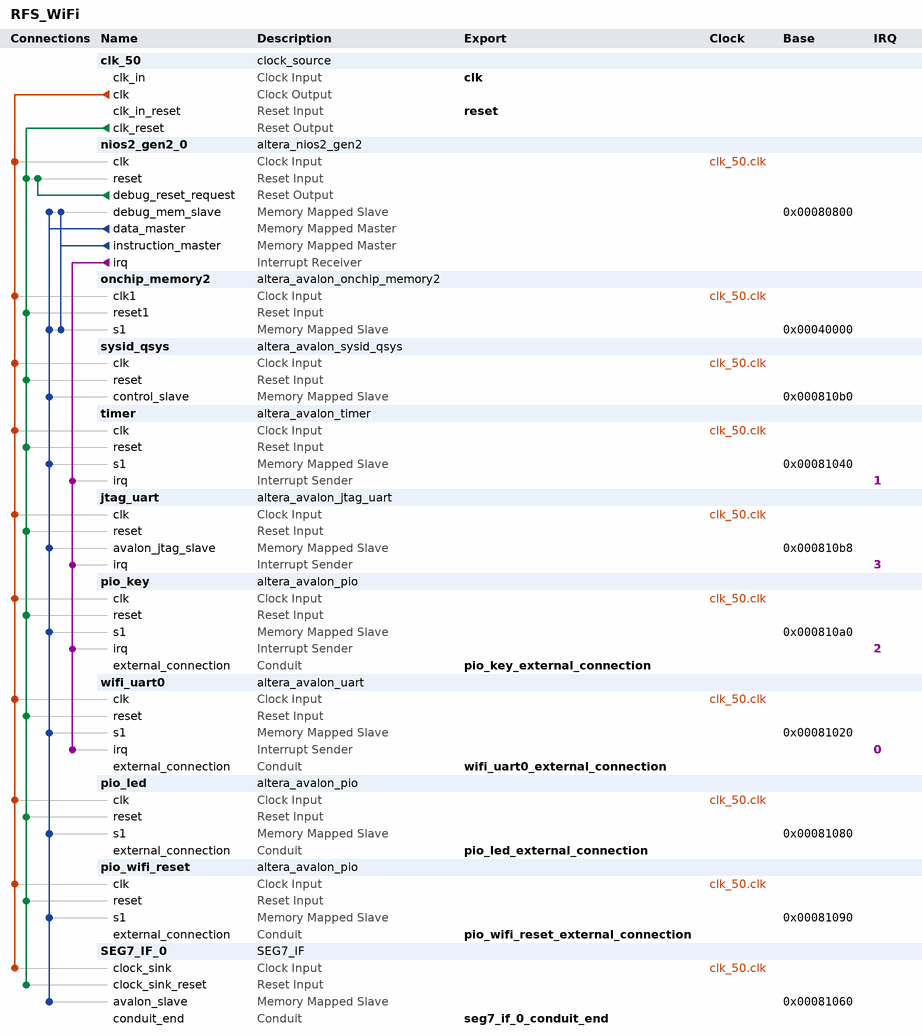
[diagram p0: system contents]
# Platform Designer (Qsys) system RFS_WiFi, Cyclone V 5CSEBA6U23I7
# Parameters at their usual value, and those the tool derives, are not listed.
package require -exact qsys 16.1
create_system RFS_WiFi
set_project_property DEVICE_FAMILY {Cyclone V}
set_project_property DEVICE 5CSEBA6U23I7

add_instance clk_50 clock_source 16.1
set_instance_parameter_value clk_50 clockFrequency 50000000

add_instance nios2_gen2_0 altera_nios2_gen2 16.1
set_instance_parameter_value nios2_gen2_0 dcache_size 2048
set_instance_parameter_value nios2_gen2_0 exceptionSlave onchip_memory2.s1
set_instance_parameter_value nios2_gen2_0 icache_size 4096
set_instance_parameter_value nios2_gen2_0 impl Fast
set_instance_parameter_value nios2_gen2_0 resetSlave onchip_memory2.s1

add_instance onchip_memory2 altera_avalon_onchip_memory2 16.1
set_instance_parameter_value onchip_memory2 dataWidth 32
set_instance_parameter_value onchip_memory2 dualPort false
set_instance_parameter_value onchip_memory2 initMemContent false
set_instance_parameter_value onchip_memory2 initializationFileName onchip_mem.hex
set_instance_parameter_value onchip_memory2 memorySize 150000

add_instance sysid_qsys altera_avalon_sysid_qsys 16.1
set_instance_parameter_value sysid_qsys id 0

add_instance timer altera_avalon_timer 16.1
set_instance_parameter_value timer period 1
set_instance_parameter_value timer periodUnits MSEC

add_instance jtag_uart altera_avalon_jtag_uart 16.1
set_instance_parameter_value jtag_uart simInteractiveOptions NO_INTERACTIVE_WINDOWS

add_instance pio_key altera_avalon_pio 16.1
set_instance_parameter_value pio_key captureEdge true
set_instance_parameter_value pio_key direction Input
set_instance_parameter_value pio_key edgeType FALLING
set_instance_parameter_value pio_key generateIRQ true
set_instance_parameter_value pio_key irqType EDGE
set_instance_parameter_value pio_key simDrivenValue 15
set_instance_parameter_value pio_key width 2

add_instance wifi_uart0 altera_avalon_uart 16.1
set_instance_parameter_value wifi_uart0 baud 115200
set_instance_parameter_value wifi_uart0 dataBits 8
set_instance_parameter_value wifi_uart0 fixedBaud true
set_instance_parameter_value wifi_uart0 parity NONE
set_instance_parameter_value wifi_uart0 stopBits 1
set_instance_parameter_value wifi_uart0 useCtsRts true

add_instance pio_led altera_avalon_pio 16.1
set_instance_parameter_value pio_led direction Output
set_instance_parameter_value pio_led width 4

add_instance pio_wifi_reset altera_avalon_pio 16.1
set_instance_parameter_value pio_wifi_reset direction Output
set_instance_parameter_value pio_wifi_reset resetValue 1
set_instance_parameter_value pio_wifi_reset width 1

add_instance SEG7_IF_0 SEG7_IF 1.0
set_instance_parameter_value SEG7_IF_0 SEG7_NUM 6

# connections
add_connection clk_50.clk jtag_uart.clk clock
add_connection clk_50.clk nios2_gen2_0.clk clock
add_connection clk_50.clk onchip_memory2.clk1 clock
add_connection clk_50.clk pio_key.clk clock
add_connection clk_50.clk pio_led.clk clock
add_connection clk_50.clk pio_wifi_reset.clk clock
add_connection clk_50.clk SEG7_IF_0.clock_sink clock
add_connection clk_50.clk sysid_qsys.clk clock
add_connection clk_50.clk timer.clk clock
add_connection clk_50.clk wifi_uart0.clk clock
add_connection clk_50.clk_reset jtag_uart.reset reset
add_connection clk_50.clk_reset nios2_gen2_0.reset reset
add_connection clk_50.clk_reset onchip_memory2.reset1 reset
add_connection clk_50.clk_reset pio_key.reset reset
add_connection clk_50.clk_reset pio_led.reset reset
add_connection clk_50.clk_reset pio_wifi_reset.reset reset
add_connection clk_50.clk_reset SEG7_IF_0.clock_sink_reset reset
add_connection clk_50.clk_reset sysid_qsys.reset reset
add_connection clk_50.clk_reset timer.reset reset
add_connection clk_50.clk_reset wifi_uart0.reset reset
add_connection nios2_gen2_0.debug_reset_request nios2_gen2_0.reset reset
add_connection nios2_gen2_0.data_master jtag_uart.avalon_jtag_slave avalon
set_connection_parameter_value nios2_gen2_0.data_master/jtag_uart.avalon_jtag_slave baseAddress 0x000810b8
add_connection nios2_gen2_0.data_master nios2_gen2_0.debug_mem_slave avalon
set_connection_parameter_value nios2_gen2_0.data_master/nios2_gen2_0.debug_mem_slave baseAddress 0x00080800
add_connection nios2_gen2_0.data_master onchip_memory2.s1 avalon
set_connection_parameter_value nios2_gen2_0.data_master/onchip_memory2.s1 baseAddress 0x00040000
add_connection nios2_gen2_0.data_master pio_key.s1 avalon
set_connection_parameter_value nios2_gen2_0.data_master/pio_key.s1 baseAddress 0x000810a0
add_connection nios2_gen2_0.data_master pio_led.s1 avalon
set_connection_parameter_value nios2_gen2_0.data_master/pio_led.s1 baseAddress 0x00081080
add_connection nios2_gen2_0.data_master pio_wifi_reset.s1 avalon
set_connection_parameter_value nios2_gen2_0.data_master/pio_wifi_reset.s1 baseAddress 0x00081090
add_connection nios2_gen2_0.data_master SEG7_IF_0.avalon_slave avalon
set_connection_parameter_value nios2_gen2_0.data_master/SEG7_IF_0.avalon_slave baseAddress 0x00081060
add_connection nios2_gen2_0.data_master sysid_qsys.control_slave avalon
set_connection_parameter_value nios2_gen2_0.data_master/sysid_qsys.control_slave baseAddress 0x000810b0
add_connection nios2_gen2_0.data_master timer.s1 avalon
set_connection_parameter_value nios2_gen2_0.data_master/timer.s1 baseAddress 0x00081040
add_connection nios2_gen2_0.data_master wifi_uart0.s1 avalon
set_connection_parameter_value nios2_gen2_0.data_master/wifi_uart0.s1 baseAddress 0x00081020
add_connection nios2_gen2_0.instruction_master nios2_gen2_0.debug_mem_slave avalon
set_connection_parameter_value nios2_gen2_0.instruction_master/nios2_gen2_0.debug_mem_slave baseAddress 0x00080800
add_connection nios2_gen2_0.instruction_master onchip_memory2.s1 avalon
set_connection_parameter_value nios2_gen2_0.instruction_master/onchip_memory2.s1 baseAddress 0x00040000
add_connection nios2_gen2_0.irq jtag_uart.irq interrupt
set_connection_parameter_value nios2_gen2_0.irq/jtag_uart.irq irqNumber 3
add_connection nios2_gen2_0.irq pio_key.irq interrupt
set_connection_parameter_value nios2_gen2_0.irq/pio_key.irq irqNumber 2
add_connection nios2_gen2_0.irq timer.irq interrupt
set_connection_parameter_value nios2_gen2_0.irq/timer.irq irqNumber 1
add_connection nios2_gen2_0.irq wifi_uart0.irq interrupt
set_connection_parameter_value nios2_gen2_0.irq/wifi_uart0.irq irqNumber 0

# exported interfaces
add_interface clk clock sink
set_interface_property clk EXPORT_OF clk_50.clk_in
add_interface pio_key_external_connection conduit end
set_interface_property pio_key_external_connection EXPORT_OF pio_key.external_connection
add_interface pio_led_external_connection conduit end
set_interface_property pio_led_external_connection EXPORT_OF pio_led.external_connection
add_interface pio_wifi_reset_external_connection conduit end
set_interface_property pio_wifi_reset_external_connection EXPORT_OF pio_wifi_reset.external_connection
add_interface reset reset sink
set_interface_property reset EXPORT_OF clk_50.clk_in_reset
add_interface seg7_if_0_conduit_end conduit end
set_interface_property seg7_if_0_conduit_end EXPORT_OF SEG7_IF_0.conduit_end
add_interface wifi_uart0_external_connection conduit end
set_interface_property wifi_uart0_external_connection EXPORT_OF wifi_uart0.external_connection

set_interconnect_requirement {$system} qsys_mm.clockCrossingAdapter HANDSHAKE
set_interconnect_requirement {$system} qsys_mm.maxAdditionalLatency 1

save_system RFS_WiFi.qsys
